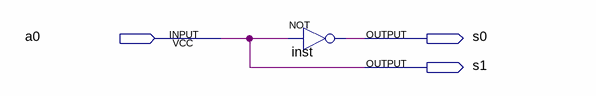
[diagram p0: schematic sheet]
// Quartus schematic decod1x2.bdf as structural Verilog: 1 symbols, 3 pins
module decod1x2 (
  input  a0,
  output s0,
  output s1
);

  not inst (s0, a0);

  assign s1 = a0;
endmodule
